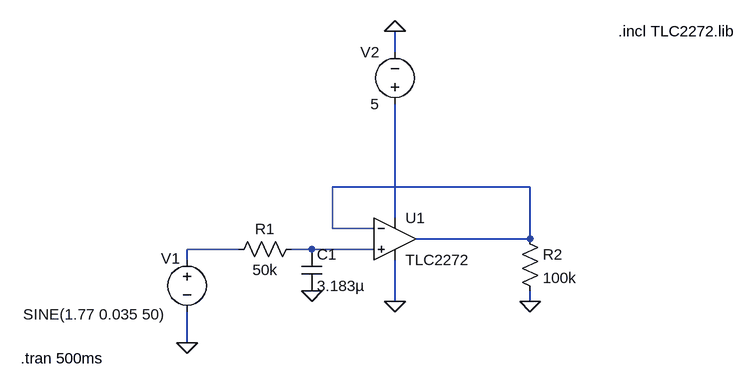
[diagram p0: schematic _Lowpass_Noninverting_TLC2272.asc]
_Lowpass_Noninverting_TLC2272.asc, the LTspice schematic file:
Version 4
SHEET 1 1944 680
WIRE 1312 -64 1312 -96
WIRE 1520 144 1216 144
WIRE 1312 192 1312 16
WIRE 1216 208 1216 144
WIRE 1280 208 1216 208
WIRE 1520 224 1520 144
WIRE 1520 224 1344 224
WIRE 1072 240 992 240
WIRE 1184 240 1152 240
WIRE 1280 240 1184 240
WIRE 992 256 992 240
WIRE 1312 320 1312 256
WIRE 1520 320 1520 304
WIRE 992 384 992 336
FLAG 1312 320 0
FLAG 1520 320 0
FLAG 992 384 0
FLAG 1312 -96 0
FLAG 1184 304 0
SYMBOL Opamps\\opamp2 1312 160 R0
SYMATTR InstName U1
SYMATTR Value TLC2272
SYMBOL res 1168 224 R90
WINDOW 0 0 56 VBottom 2
WINDOW 3 32 56 VTop 2
SYMATTR InstName R1
SYMATTR Value 50k
SYMBOL res 1504 208 R0
SYMATTR InstName R2
SYMATTR Value 100k
SYMBOL voltage 992 240 R0
WINDOW 3 -252 100 Left 2
WINDOW 123 24 72 Left 2
WINDOW 39 0 0 Left 0
WINDOW 0 -40 14 Left 2
SYMATTR Value SINE(1.77 0.035 50)
SYMATTR InstName V1
SYMBOL voltage 1312 32 R180
WINDOW 0 24 96 Left 2
WINDOW 3 24 16 Left 2
WINDOW 123 0 0 Left 0
WINDOW 39 0 0 Left 0
SYMATTR InstName V2
SYMATTR Value 5
SYMBOL cap 1168 240 R0
SYMATTR InstName C1
SYMATTR Value 3.183µ
TEXT 1656 -96 Left 2 !.incl TLC2272.lib
TEXT 736 408 Left 2 !.tran 500ms

The netlist it stands for:
* _Lowpass_Noninverting_TLC2272.asc
XU1 N004 N001 N002 0 N001 TLC2272  ; pins In+ In- V+ V- OUT
R1 N004 N003 50k
R2 N001 0 100k
V1 N003 0 SINE(1.77 0.035 50)
V2 N002 0 5
C1 N004 0 3.183µ
.incl TLC2272.lib
.tran 500ms
.backanno
.end